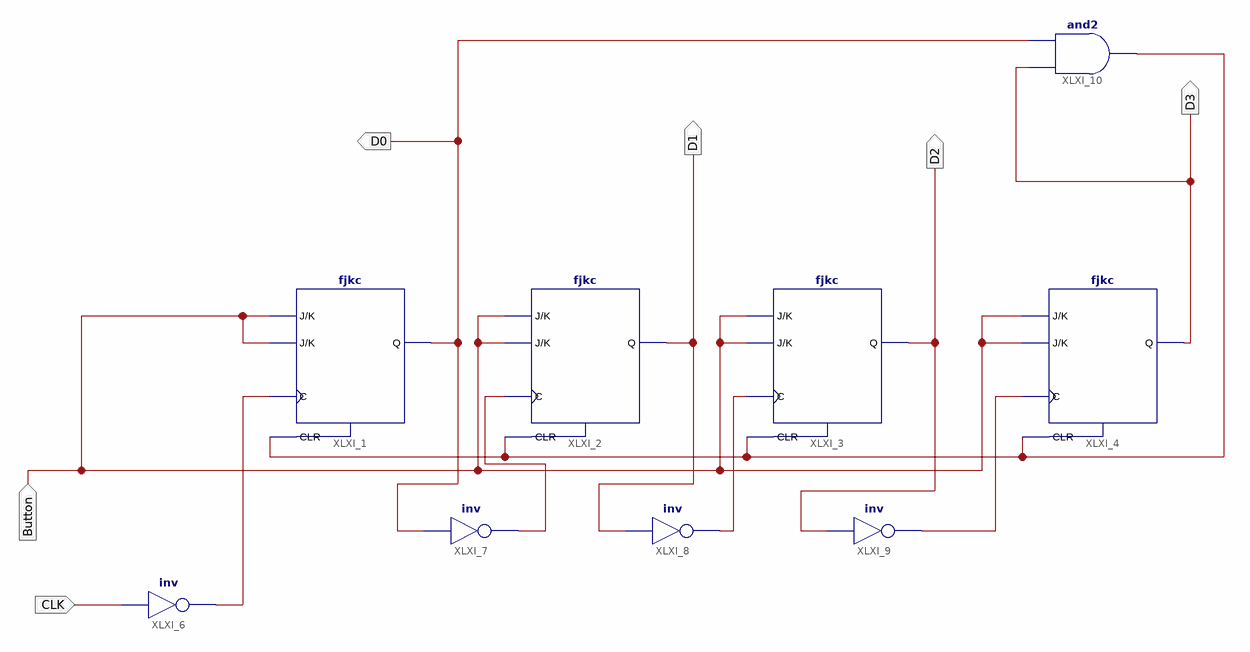
[diagram p0: schematic sheet 1]
// Xilinx ISE schematic Lab9_Counter.sch (spartan6) as structural Verilog: 9 symbols, 6 ports
module Lab9_Counter (
  input  Button,
  input  CLK,
  output D1,
  output D2,
  output D0,
  output D3
);

  wire XLXN_12, XLXN_14, XLXN_16, XLXN_21, XLXN_25;

  fjkc XLXI_1 (.C(XLXN_25), .CLR(XLXN_21), .J(Button), .K(Button), .Q(D0));
  fjkc XLXI_2 (.C(XLXN_12), .CLR(XLXN_21), .J(Button), .K(Button), .Q(D1));
  fjkc XLXI_3 (.C(XLXN_14), .CLR(XLXN_21), .J(Button), .K(Button), .Q(D2));
  fjkc XLXI_4 (.C(XLXN_16), .CLR(XLXN_21), .J(Button), .K(Button), .Q(D3));
  not XLXI_7 (XLXN_12, D0);
  not XLXI_8 (XLXN_14, D1);
  not XLXI_9 (XLXN_16, D2);
  and XLXI_10 (XLXN_21, D3, D0);
  not XLXI_6 (XLXN_25, CLK);
endmodule
